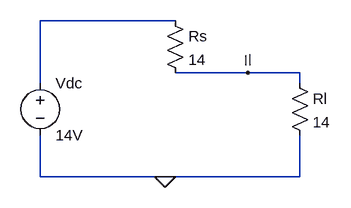
[diagram p0: schematic Draft3.asc]
Draft3.asc, the LTspice schematic file:
Version 4.1
SHEET 1 880 680
WIRE 224 16 16 16
WIRE 336 96 224 96
WIRE 416 96 336 96
WIRE 16 112 16 16
WIRE 416 112 416 96
WIRE 16 256 16 192
WIRE 208 256 16 256
WIRE 416 256 416 192
WIRE 416 256 208 256
FLAG 208 256 0
FLAG 336 96 Il
SYMBOL voltage 16 96 R0
SYMATTR InstName Vdc
SYMATTR Value 14V
SYMBOL res 208 0 R0
SYMATTR InstName Rs
SYMATTR Value 14
SYMBOL res 400 96 R0
SYMATTR InstName Rl
SYMATTR Value 14

The netlist it stands for:
* Draft3.asc
Vdc N001 0 14V
Rs N001 Il 14
Rl Il 0 14
.backanno
.end